# Altium schematic sheet [1]High_Power.SchDoc
size A1
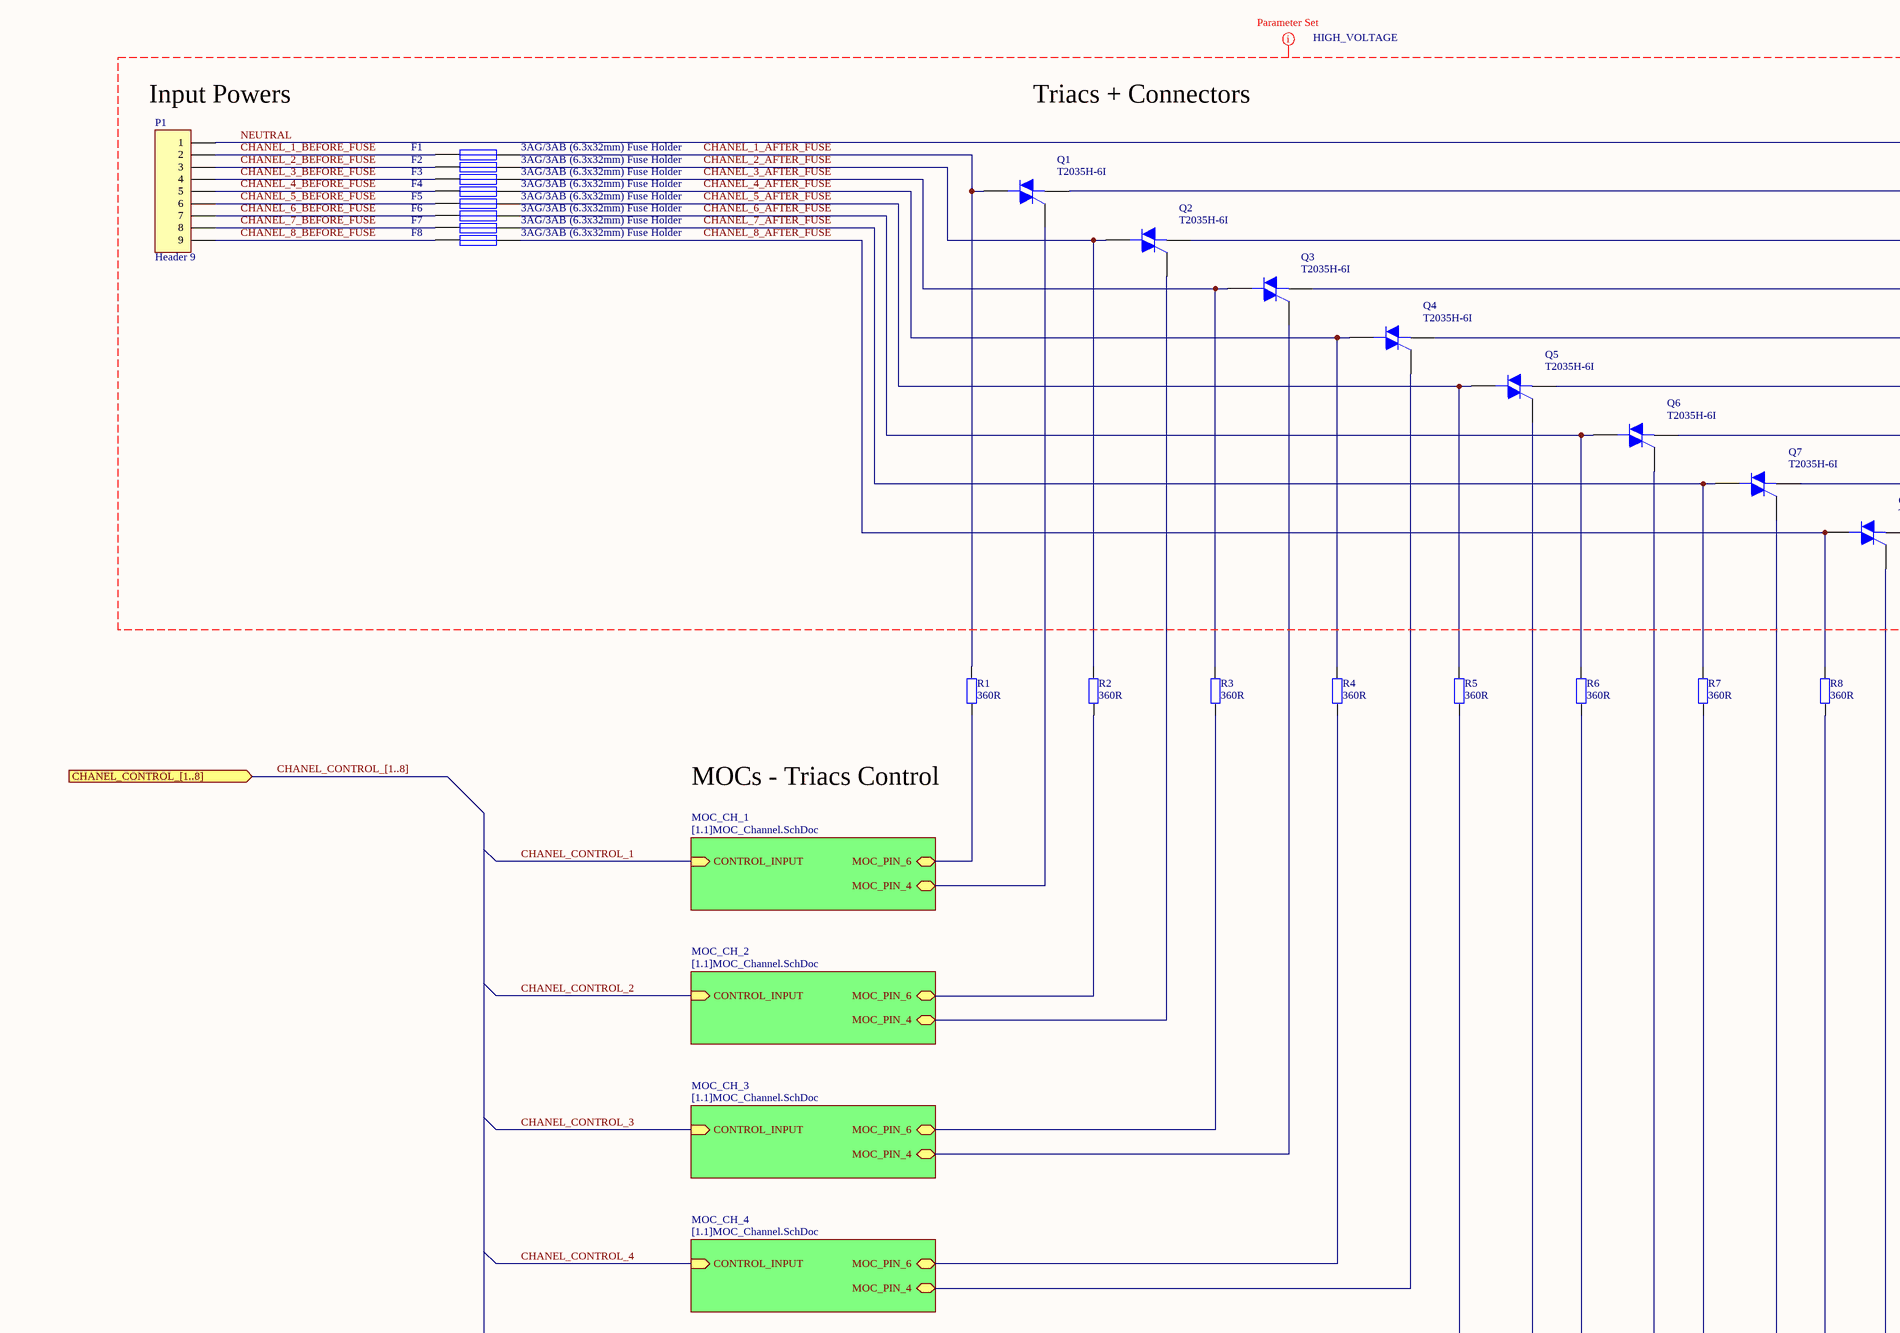
[diagram p0: [1]High_Power.SchDoc, top left]
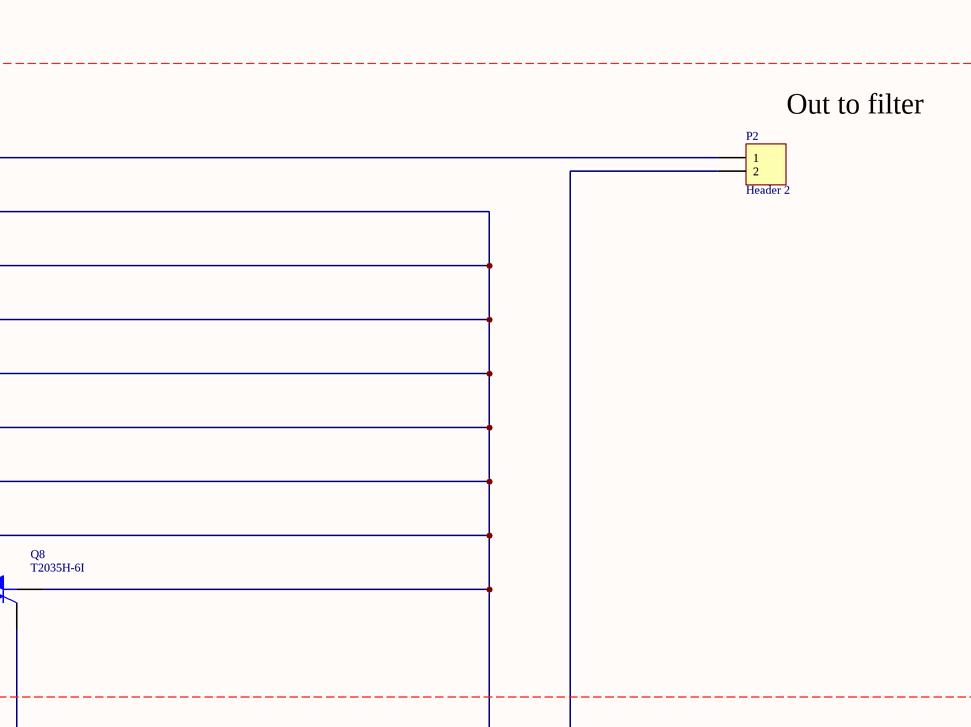
[diagram p1: [1]High_Power.SchDoc, top right]
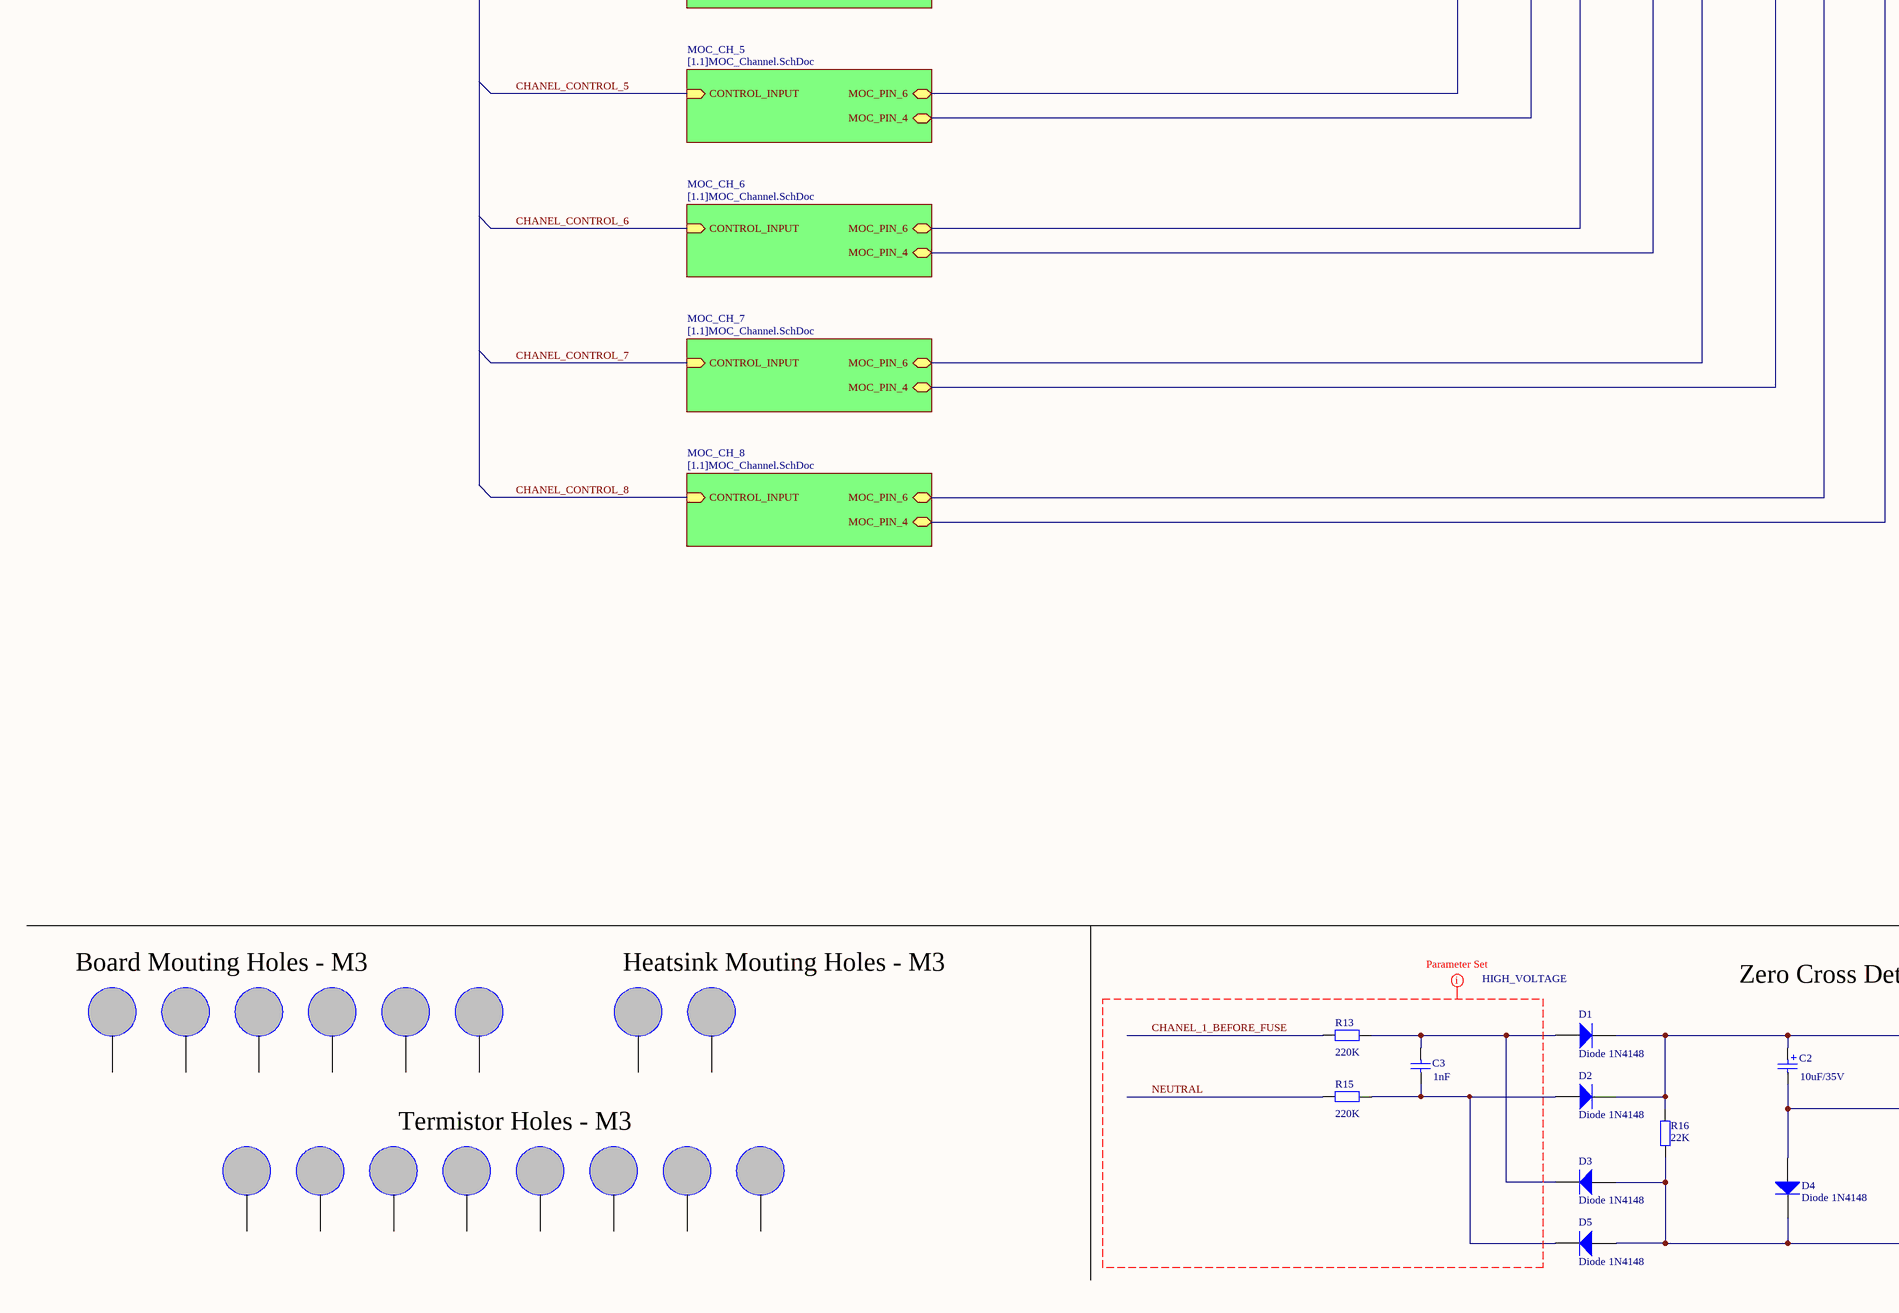
[diagram p2: [1]High_Power.SchDoc, bottom left]
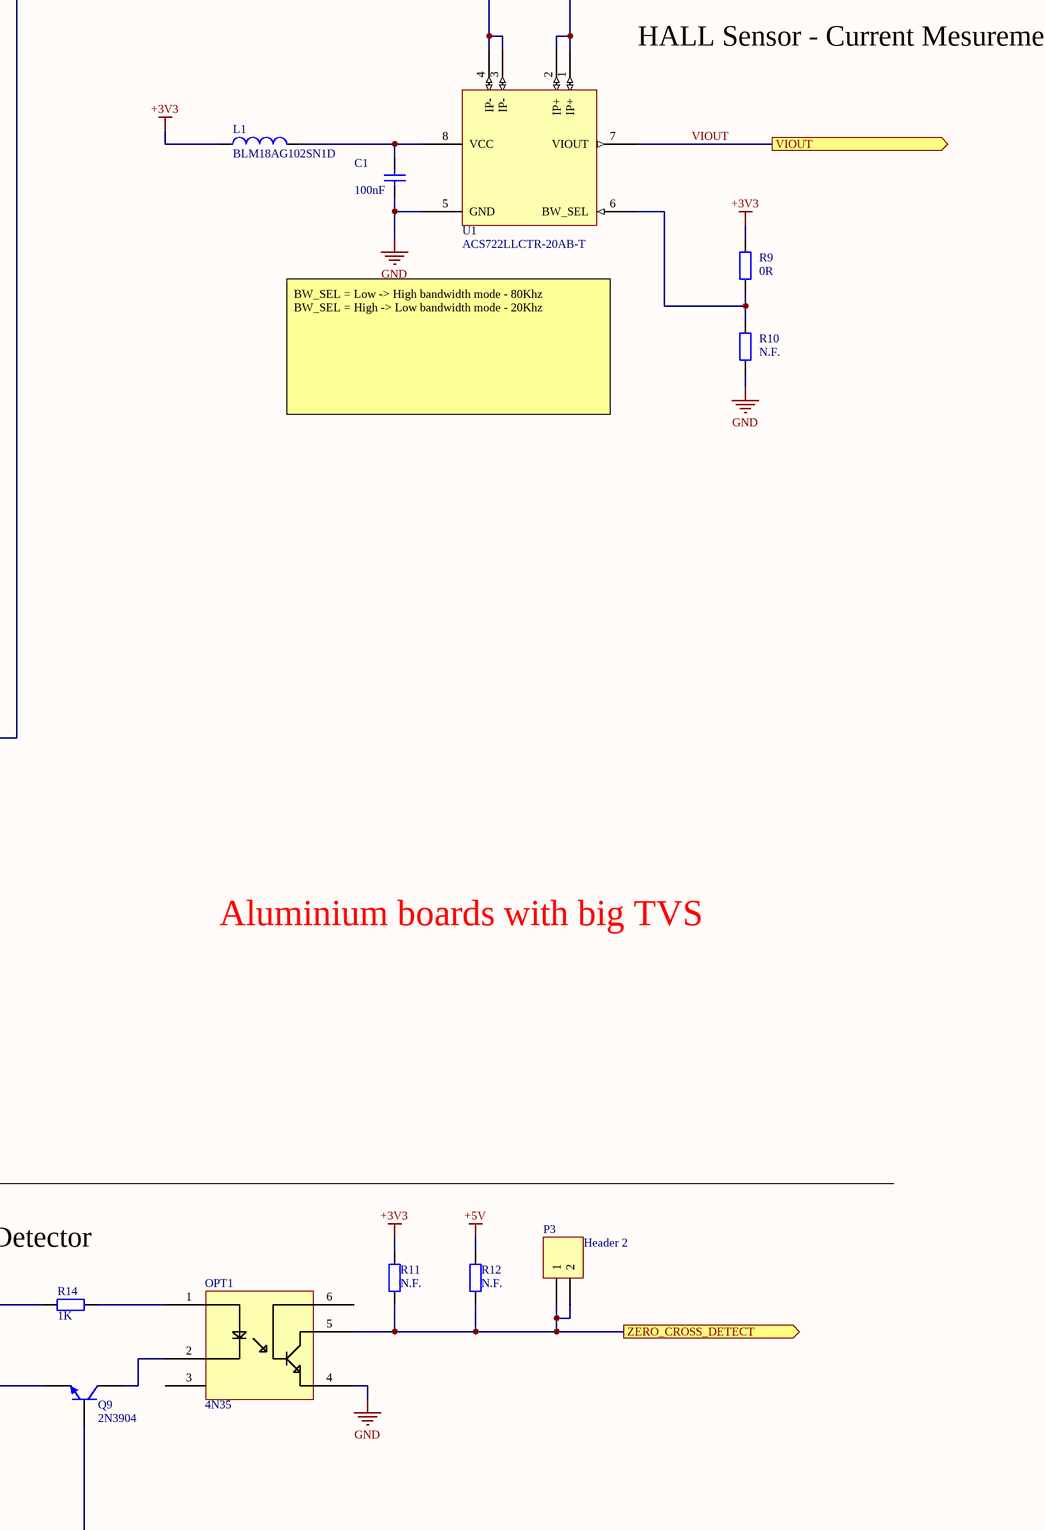
[diagram p3: [1]High_Power.SchDoc, bottom right]

## Parts
C1  value 100nF  [1608[0603]]  (hidden comment: 0603)
C2  value 10uF/35V  [WCAP-ATG5 Capacitor]  (hidden comment: Cap Pol2)
C3  value 1nF  [R82 Capacitors]  (hidden comment: 0603)
D1  Diode 1N4148  [DO-35]
D2  Diode 1N4148  [DO-35]
D3  Diode 1N4148  [DO-35]
D4  Diode 1N4148  [DO-35]
D5  Diode 1N4148  [DO-35]
F1  3AG/3AB (6.3x32mm) Fuse Holder  [03540101ZXGY]
F2  3AG/3AB (6.3x32mm) Fuse Holder  [03540101ZXGY]
F3  3AG/3AB (6.3x32mm) Fuse Holder  [03540101ZXGY]
F4  3AG/3AB (6.3x32mm) Fuse Holder  [03540101ZXGY]
F5  3AG/3AB (6.3x32mm) Fuse Holder  [03540101ZXGY]
F6  3AG/3AB (6.3x32mm) Fuse Holder  [03540101ZXGY]
F7  3AG/3AB (6.3x32mm) Fuse Holder  [03540101ZXGY]
F8  3AG/3AB (6.3x32mm) Fuse Holder  [03540101ZXGY]
L1  BLM18AG102SN1D  [1608[0603]]
MH1  Mouting Hole  [M3 Mounting Hole]  (value not drawn)  (no BOM)
MH2  Mouting Hole  [M3 Mounting Hole]  (value not drawn)  (no BOM)
MH3  Mouting Hole  [M3 Mounting Hole]  (value not drawn)  (no BOM)
MH4  Mouting Hole  [M3 Mounting Hole]  (value not drawn)  (no BOM)
MH5  Mouting Hole  [M3 Mounting Hole]  (value not drawn)  (no BOM)
MH6  Mouting Hole  [M3 Mounting Hole]  (value not drawn)  (no BOM)
MH7  Mouting Hole  [M3 Mounting Hole]  (value not drawn)  (no BOM)
MH8  Mouting Hole  [M3 Mounting Hole]  (value not drawn)  (no BOM)
MH9  Mouting Hole  [M3 Mounting Hole]  (value not drawn)  (no BOM)
MH10  Mouting Hole  [M3 Mounting Hole]  (value not drawn)  (no BOM)
MH11  Mouting Hole  [M3 Mounting Hole]  (value not drawn)  (no BOM)
MH12  Mouting Hole  [M3 Mounting Hole]  (value not drawn)  (no BOM)
MH13  Mouting Hole  [M3 Mounting Hole]  (value not drawn)  (no BOM)
MH14  Mouting Hole  [M3 Mounting Hole]  (value not drawn)  (no BOM)
MH15  Mouting Hole  [M3 Mounting Hole]  (value not drawn)  (no BOM)
MH16  Mouting Hole  [M3 Mounting Hole]  (value not drawn)  (no BOM)
OPT1  4N35  [DIP-6]
P1  Header 9  [Phoenix Contact 1732351]
P2  Header 2  [Phoenix Contact 1731721]
P3  Header 2  [HDR1X2]
Q1  T2035H-6I  [TO-220 +3D]
Q2  T2035H-6I  [TO-220 +3D]
Q3  T2035H-6I  [TO-220 +3D]
Q4  T2035H-6I  [TO-220 +3D]
Q5  T2035H-6I  [TO-220 +3D]
Q6  T2035H-6I  [TO-220 +3D]
Q7  T2035H-6I  [TO-220 +3D]
Q8  T2035H-6I  [TO-220 +3D]
Q9  2N3904  [TO-92A]
R1  value 360R  [AXIAL-0.4]  (hidden comment: Res2)
R2  value 360R  [AXIAL-0.4]  (hidden comment: Res2)
R3  value 360R  [AXIAL-0.4]  (hidden comment: Res2)
R4  value 360R  [AXIAL-0.4]  (hidden comment: Res2)
R5  value 360R  [AXIAL-0.4]  (hidden comment: Res2)
R6  value 360R  [AXIAL-0.4]  (hidden comment: Res2)
R7  value 360R  [AXIAL-0.4]  (hidden comment: Res2)
R8  value 360R  [AXIAL-0.4]  (hidden comment: Res2)
R9  value 0R  [J1-0603]  (hidden comment: 0603)
R10  value N.F.  [J1-0603]  (hidden comment: 0603)
R11  value N.F.  [J1-0603]  (hidden comment: 0603)
R12  value N.F.  [J1-0603]  (hidden comment: 0603)
R13  value 220K  [AXIAL-0.4]  (hidden comment: Res2)
R14  value 1K  [AXIAL-0.4]  (hidden comment: Res2)
R15  value 220K  [AXIAL-0.4]  (hidden comment: Res2)
R16  value 22K  [AXIAL-0.4]  (hidden comment: Res2)
U1  ACS722LLCTR-20AB-T  [SOIC127P600-8CL]

## Sub-sheets
MOC_CH_1 = [1.1]MOC_Channel.SchDoc: MOC_PIN_4 (bidir), CONTROL_INPUT (in), MOC_PIN_6 (bidir)
MOC_CH_2 = [1.1]MOC_Channel.SchDoc: MOC_PIN_4 (bidir), CONTROL_INPUT (in), MOC_PIN_6 (bidir)
MOC_CH_3 = [1.1]MOC_Channel.SchDoc: MOC_PIN_4 (bidir), CONTROL_INPUT (in), MOC_PIN_6 (bidir)
MOC_CH_4 = [1.1]MOC_Channel.SchDoc: MOC_PIN_4 (bidir), CONTROL_INPUT (in), MOC_PIN_6 (bidir)
MOC_CH_5 = [1.1]MOC_Channel.SchDoc: MOC_PIN_4 (bidir), CONTROL_INPUT (in), MOC_PIN_6 (bidir)
MOC_CH_6 = [1.1]MOC_Channel.SchDoc: MOC_PIN_4 (bidir), CONTROL_INPUT (in), MOC_PIN_6 (bidir)
MOC_CH_7 = [1.1]MOC_Channel.SchDoc: MOC_PIN_4 (bidir), CONTROL_INPUT (in), MOC_PIN_6 (bidir)
MOC_CH_8 = [1.1]MOC_Channel.SchDoc: MOC_PIN_4 (bidir), CONTROL_INPUT (in), MOC_PIN_6 (bidir)

## Ports
CHANEL_CONTROL_[1..8] (in), VIOUT (out), ZERO_CROSS_DETECT (out)

## Nets
+3V3: L1.1 R9.2 R11.1
+5V: R12.1
GND: C1.1 OPT1.4(E) R10.1 U1.5(GND)
CHANEL_1_AFTER_FUSE: F1.2 Q1.2(M2) R1.2
CHANEL_1_BEFORE_FUSE: F1.1 P1.2 R13.1
CHANEL_2_AFTER_FUSE: F2.2 Q2.2(M2) R2.2
CHANEL_2_BEFORE_FUSE: F2.1 P1.3
CHANEL_3_AFTER_FUSE: F3.2 Q3.2(M2) R3.2
CHANEL_3_BEFORE_FUSE: F3.1 P1.4
CHANEL_4_AFTER_FUSE: F4.2 Q4.2(M2) R4.2
CHANEL_4_BEFORE_FUSE: F4.1 P1.5
CHANEL_5_AFTER_FUSE: F5.2 Q5.2(M2) R5.2
CHANEL_5_BEFORE_FUSE: F5.1 P1.6
CHANEL_6_AFTER_FUSE: F6.2 Q6.2(M2) R6.2
CHANEL_6_BEFORE_FUSE: F6.1 P1.7
CHANEL_7_AFTER_FUSE: F7.2 Q7.2(M2) R7.2
CHANEL_7_BEFORE_FUSE: F7.1 P1.8
CHANEL_8_AFTER_FUSE: F8.2 Q8.2(M2) R8.2
CHANEL_8_BEFORE_FUSE: F8.1 P1.9
CHANEL_CONTROL_1: sheet MOC_CH_1/CONTROL_INPUT
CHANEL_CONTROL_2: sheet MOC_CH_2/CONTROL_INPUT
CHANEL_CONTROL_3: sheet MOC_CH_3/CONTROL_INPUT
CHANEL_CONTROL_4: sheet MOC_CH_4/CONTROL_INPUT
CHANEL_CONTROL_5: sheet MOC_CH_5/CONTROL_INPUT
CHANEL_CONTROL_6: sheet MOC_CH_6/CONTROL_INPUT
CHANEL_CONTROL_7: sheet MOC_CH_7/CONTROL_INPUT
CHANEL_CONTROL_8: sheet MOC_CH_8/CONTROL_INPUT
NEUTRAL: P1.1 P2.1 R15.1
VIOUT: U1.7(VIOUT) ; port VIOUT
ZERO_CROSS_DETECT: OPT1.5(C) P3.1 P3.2 R11.2 R12.2 ; port ZERO_CROSS_DETECT
NetC1_2: C1.2 L1.2 U1.8(VCC)
NetC2_1: C2.1 D1.2(K) D2.2(K) R14.2 R16.2
NetC2_2: C2.2 D4.1(A) Q9.1(E)
NetC3_1: C3.1 D2.1(A) D5.2(K) R15.2
NetC3_2: C3.2 D1.1(A) D3.2(K) R13.2
NetD3_1: D3.1(A) D4.2(K) D5.1(A) Q9.2(B) R16.1
NetOPT1_1: OPT1.1(A) R14.1
NetOPT1_2: OPT1.2(C) Q9.3(C)
NetP2_2: P2.2 U1.1(IP+) U1.2(IP+)
NetQ1_1: Q1.1(M1) Q2.1(M1) Q3.1(M1) Q4.1(M1) Q5.1(M1) Q6.1(M1) Q7.1(M1) Q8.1(M1) U1.3(IP-) U1.4(IP-)
NetQ1_3: Q1.3(G) ; sheet MOC_CH_1/MOC_PIN_4
NetQ2_3: Q2.3(G) ; sheet MOC_CH_2/MOC_PIN_4
NetQ3_3: Q3.3(G) ; sheet MOC_CH_3/MOC_PIN_4
NetQ4_3: Q4.3(G) ; sheet MOC_CH_4/MOC_PIN_4
NetQ5_3: Q5.3(G) ; sheet MOC_CH_5/MOC_PIN_4
NetQ6_3: Q6.3(G) ; sheet MOC_CH_6/MOC_PIN_4
NetQ7_3: Q7.3(G) ; sheet MOC_CH_7/MOC_PIN_4
NetQ8_3: Q8.3(G) ; sheet MOC_CH_8/MOC_PIN_4
NetR1_1: R1.1 ; sheet MOC_CH_1/MOC_PIN_6
NetR2_1: R2.1 ; sheet MOC_CH_2/MOC_PIN_6
NetR3_1: R3.1 ; sheet MOC_CH_3/MOC_PIN_6
NetR4_1: R4.1 ; sheet MOC_CH_4/MOC_PIN_6
NetR5_1: R5.1 ; sheet MOC_CH_5/MOC_PIN_6
NetR6_1: R6.1 ; sheet MOC_CH_6/MOC_PIN_6
NetR7_1: R7.1 ; sheet MOC_CH_7/MOC_PIN_6
NetR8_1: R8.1 ; sheet MOC_CH_8/MOC_PIN_6
NetR9_1: R9.1 R10.2 U1.6(BW_SEL)

Not connected (* = marked no-connect by the designer): MH1 1; MH2 1; MH3 1; MH4 1; MH5 1; MH6 1; MH7 1; MH8 1; MH9 1; MH10 1; MH11 1; MH12 1; MH13 1; MH14 1; MH15 1; MH16 1; OPT1 3(NC) 6(B)

## Buses and harness runs
bus CHANEL_CONTROL_[1..8] = port CHANEL_CONTROL_[1..8]

## Layout directives
net class HIGH_VOLTAGE: CHANEL_1_AFTER_FUSE, CHANEL_1_BEFORE_FUSE, CHANEL_2_AFTER_FUSE, CHANEL_2_BEFORE_FUSE, CHANEL_3_AFTER_FUSE, CHANEL_3_BEFORE_FUSE, CHANEL_4_AFTER_FUSE, CHANEL_4_BEFORE_FUSE, CHANEL_5_AFTER_FUSE, CHANEL_5_BEFORE_FUSE, CHANEL_6_AFTER_FUSE, CHANEL_6_BEFORE_FUSE, CHANEL_7_AFTER_FUSE, CHANEL_7_BEFORE_FUSE, CHANEL_8_AFTER_FUSE, CHANEL_8_BEFORE_FUSE, NEUTRAL

## Notes on the sheet
- (near P1) Input Powers
- Triacs + Connectors
- Out to filter
- MOCs - Triacs Control
- HALL Sensor - Current Mesurement
- BW_SEL = Low -> High bandwidth mode - 80Khz
  BW_SEL = High -> Low bandwidth mode - 20Khz
- Aluminium boards with big TVS
- Board Mouting Holes - M3
- Heatsink Mouting Holes - M3
- Zero Cross Detector
- Termistor Holes - M3

## Library data of the parts
C1 = Cap: Capacitor; Note: We have them in Bulgaria; Published: 8-Jun-2000; LatestRevisionDate: 17-Jul-2002; LatestRevisionNote: Re-released for DXP Platform.; PackageReference: RAD-0.3; Publisher: Altium Limited; PackageDescription: Radial Cap, Thru-Hole; 2 Leads; 0.3 in Pin Spacing; Distributor Link: http://uk.farnell.com/kemet/c0603x104k4ractu/cap-mlcc-x7r-100nf-16v-0603/dp/1414027; Case Code (in): 0603
C2 = Cap Pol2: Polarized Capacitor (Axial); Manufacturer Name: Wurth Elektronik; Manufacturer Part No.: 860010572002; Published: 8-Jun-2000; LatestRevisionDate: 17-Jul-2002; LatestRevisionNote: Re-released for DXP Platform.; PackageReference: POLAR0.8; Publisher: Altium Limited; PackageDescription: Polarized Capacitor; 2 Leads; Distributor Link: https://eu.mouser.com/ProductDetail/Wurth-Elektronik/860010572002?qs=sGAEpiMZZMtZ1n0r9vR22emd73sC8nR%2FeIw40At6znBuqpN1zy5iZQ%3D%3D
C3 = Cap: Capacitor; Manufacturer Name: Kemet; Manufacturer Part No.: R82EC1100SH50J; Published: 8-Jun-2000; LatestRevisionDate: 17-Jul-2002; LatestRevisionNote: Re-released for DXP Platform.; PackageReference: RAD-0.3; Publisher: Altium Limited; PackageDescription: Radial Cap, Thru-Hole; 2 Leads; 0.3 in Pin Spacing; Distributor Link: https://eu.mouser.com/ProductDetail/KEMET/R82EC1100SH50J?qs=Jv4FAWB%252B0HZZcejnl%252BmKFw%3D%3D
D1-D5 = Diode 1N4148: High Conductance Fast Diode; Manufacturer Name: ON Semiconductor / Fairchild; Published: 8-Jun-2000; LatestRevisionDate: 17-Jul-2002; LatestRevisionNote: Re-released for DXP Platform.; DatasheetVersion: 1997; PackageReference: DO-35; Publisher: Altium Limited; PackageDescription: Diode, Axial; Body 3.8 x 1.9 mm (LxDia. max), Lead Dia. 0.53 mm (max); Code_JEDEC: DO-204-AH; ComponentLink1Description: Manufacturer Link; ComponentLink1URL: http://www.fairchildsemi.com/; ComponentLink2Description: Datasheet; ComponentLink2URL: http://www.fairchildsemi.com/ds/1N%2F1N4148.pdf; Distributor Link: https://www.mouser.co.uk/ProductDetail/ON-Semiconductor-Fairchild/1N4148?qs=i4Fj9T%2FoRm8RMUhj5DeFQg%3D%3D; Manufacturer Part No.: 1N4148
F1-F8 = Fuse 1: Fuse; Manufacturer Name: Littelfuse; Published: 8-Jun-2000; LatestRevisionDate: 17-Jul-2002; LatestRevisionNote: Re-released for DXP Platform.; PackageReference: PIN-W2/E2.8; Publisher: Altium Limited; PackageDescription: Thru-Hole; 2 Leads; Distributor Link: https://eu.mouser.com/ProductDetail/Littelfuse/03540101ZXGY?qs=gu7KAQ731USHq53hZeD4aA%3D%3D; Manufacturer Part No.: 03540101ZXGY
L1 = Inductor: Manufacturer Name: Murata; Note: We have them in Bulgaria; Manufacturer Part No.: BLM18AG102SN1D; Distributor Link: https://eu.mouser.com/ProductDetail/Murata-Electronics/BLM18AG102SN1D?qs=%2fha2pyFadui%252bmEFJIul6r5GpWOyARRlB97lxmShlzChqi9G%252bTjWC9w%3d%3d
OPT1 = 4N35: Optocoupler, Phototransistor Output, with Base Connection; Manufacturer Name: VISHAY; Note: Get 3 more; Distributor Link: https://uk.farnell.com/vishay/4n35/optocoupler-phototransistor-5000vrms/dp/1328375; Manufacturer Part No.: 4N35
P1 = Header 9: Header, 9-Pin; Manufacturer Name: 1732351; Manufacturer Part No.: Phoenix Contact; LatestRevisionDate: 17-Jul-2002; LatestRevisionNote: Re-released for DXP Platform.; Publisher: Altium Limited; Distributor Link: https://eu.mouser.com/ProductDetail/Phoenix-Contact/1732351?qs=%2Fha2pyFaduil4dlFYt6J%252B%2F5QyjaYJ9xdI09CSKJ9bpIMs31xZuIXQ81zvmcHehum
P2 = Header 2: Header, 2-Pin; Manufacturer Name: Phoenix Contact; Manufacturer Part No.: 1732351; LatestRevisionDate: 17-Jul-2002; LatestRevisionNote: Re-released for DXP Platform.; Publisher: Altium Limited; Distributor Link: https://www.mouser.co.uk/ProductDetail/651-1732351
P3 = Header 2: Header, 2-Pin; LatestRevisionDate: 17-Jul-2002; LatestRevisionNote: Re-released for DXP Platform.; Publisher: Altium Limited
Q1-Q8 = Triac: Silicon Bidirectional Triode Thyristor; Manufacturer Name: STMicroelectronics; Note: Get 30 more of those.; Published: 29-Sep-2000; LatestRevisionDate: 17-Jul-2002; LatestRevisionNote: Re-released for DXP Platform.; DatasheetVersion: 1999; PackageReference: 369-03; Publisher: Altium Limited; PackageDescription: TO, Thru-Hole, Vertical, Heatsink Mounted; 3 In-Line Leads; Pitch 2.28 mm; ComponentLink1Description: Manufacturer Link; ComponentLink1URL: http://www.motorola.com/; Distributor Link: https://eu.mouser.com/ProductDetail/STMicroelectronics/T2035H-6I?qs=%2Fha2pyFaduhTzOBoTM%252BH2lIkzhHcz3YMyX%252BQq7FR7LM%3D; Manufacturer Part No.: T2035H-6I
Q9 = 2N3904: NPN General Purpose Amplifier; Manufacturer Name: MULTICOMP; Published: 8-Jun-2000; LatestRevisionDate: 15-Jan-2003; LatestRevisionNote: PCB Footprint 'BCY-W3/D4.7' replaced; DatasheetVersion: 1997; PackageVersion: Sep-1998; PackageReference: TO-92A; Publisher: Altium Limited; PackageDescription: TO, Flat Index; 3 In-Line, Axial Leads; Body Dia. 4.5mm; Leads 0.51 x 0.48 mm (max); ComponentLink1Description: Manufacturer Link; ComponentLink1URL: http://www.fairchildsemi.com/; ComponentLink2Description: Datasheet; ComponentLink2URL: http://www.fairchildsemi.com/ds/2N%2F2N3904.pdf; Distributor Link: https://uk.farnell.com/multicomp/2n3904/transistor-npn-to-92/dp/1574370?st=2N3904; Manufacturer Part No.: 2N3904
R1-R8 R13-R16 = Res2: Resistor; Note: Get 6 more of those.; Published: 8-Jun-2000; LatestRevisionDate: 17-Jul-2002; LatestRevisionNote: Re-released for DXP Platform.; PackageReference: AXIAL-0.4; Publisher: Altium Limited; PackageDescription: Axial Device, Thru-Hole; 2 Leads; 0.4 in Pin Spacing; Case Code (in): AXIAL-0.3
  R1-R8: Distributor Link: https://eu.mouser.com/ProductDetail/Yageo/CFR-25JB-52-360R?qs=sGAEpiMZZMsPqMdJzcrNwqM9OSsfvmTTETvHHPXiM%2FLP9NH589sNFg%3D%3D
  R13 R15: Distributor Link: https://eu.mouser.com/ProductDetail/Yageo/CFR-25JT-52-220K?qs=sGAEpiMZZMsPqMdJzcrNwiPCnpFTGbbhcMzgIt4VkwM%3D
  R14: Distributor Link: https://eu.mouser.com/ProductDetail/Yageo/CFR-12JT-52-1K?qs=sGAEpiMZZMsPqMdJzcrNwnIafLS3rQ8ceX3eBr2isTY%3D
  R16: Distributor Link: https://eu.mouser.com/ProductDetail/Vishay-Dale/CCF0722K0JKE36?qs=sGAEpiMZZMsPqMdJzcrNwpBqoc5gprOUzoFaNNDlFDY%3D
R9-R12 = Res2: Resistor; Note: We have them in Bulgaria; Published: 8-Jun-2000; LatestRevisionDate: 17-Jul-2002; LatestRevisionNote: Re-released for DXP Platform.; PackageReference: AXIAL-0.4; Publisher: Altium Limited; PackageDescription: Axial Device, Thru-Hole; 2 Leads; 0.4 in Pin Spacing; Case Code (in): 0603
  R9: Distributor Link: http://uk.farnell.com/yageo/rc0603fr-070rl/res-thick-film-0r-1-0-1w-0603/dp/2309106
U1 = ACS723: High-Accuracy, Galvanically Isolated Current Sensor IC / with Small Footprint SOIC8 Package; Manufacturer Name: Allegro MicroSystems; Note: Get 5 more.; Distributor Link: https://www.digikey.com/product-detail/en/allegro-microsystems-llc/ACS722LLCTR-20AB-T/620-1637-1-ND/4948873; Manufacturer Part No.: ACS722LLCTR-20AB-T